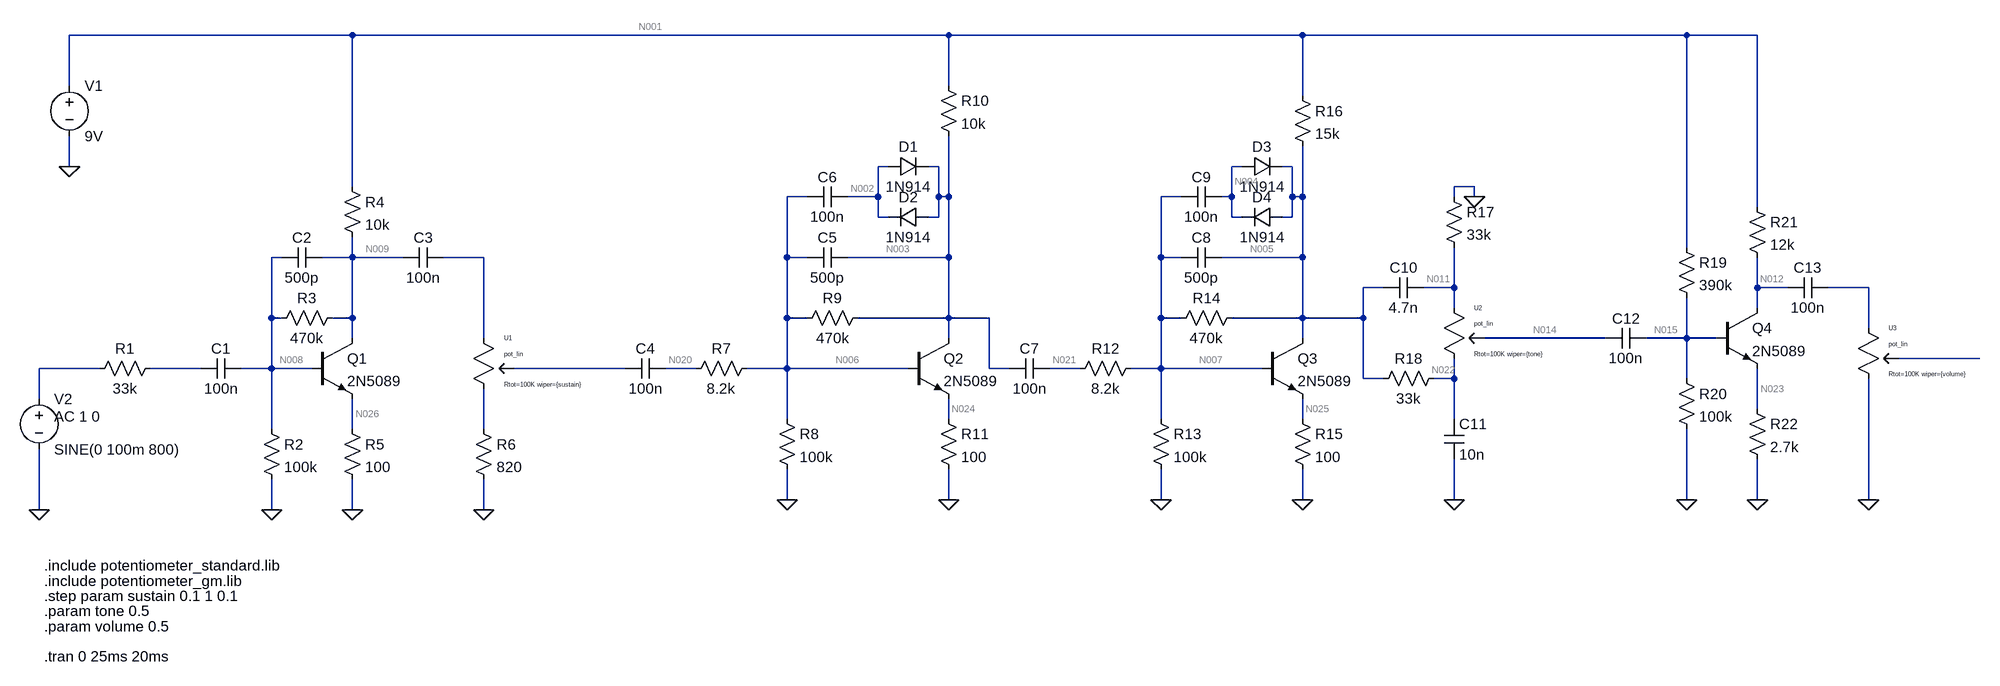
[diagram p0: schematic triangle.asc]
triangle.asc, the LTspice schematic file:
Version 4
SHEET 1 3376 680
WIRE 640 -944 192 -944
WIRE 1584 -944 640 -944
WIRE 2144 -944 1584 -944
WIRE 2752 -944 2144 -944
WIRE 2864 -944 2752 -944
WIRE 192 -864 192 -944
WIRE 1584 -864 1584 -944
WIRE 2144 -848 2144 -944
WIRE 192 -736 192 -784
WIRE 1488 -736 1472 -736
WIRE 1568 -736 1552 -736
WIRE 2048 -736 2032 -736
WIRE 2128 -736 2112 -736
WIRE 640 -704 640 -944
WIRE 2416 -704 2384 -704
WIRE 1360 -688 1328 -688
WIRE 1472 -688 1472 -736
WIRE 1472 -688 1424 -688
WIRE 1568 -688 1568 -736
WIRE 1584 -688 1584 -784
WIRE 1584 -688 1568 -688
WIRE 1952 -688 1920 -688
WIRE 2032 -688 2032 -736
WIRE 2032 -688 2016 -688
WIRE 2128 -688 2128 -736
WIRE 2144 -688 2144 -768
WIRE 2144 -688 2128 -688
WIRE 2384 -688 2384 -704
WIRE 2416 -688 2416 -704
WIRE 2864 -672 2864 -944
WIRE 1472 -656 1472 -688
WIRE 1488 -656 1472 -656
WIRE 1568 -656 1568 -688
WIRE 1568 -656 1552 -656
WIRE 2032 -656 2032 -688
WIRE 2048 -656 2032 -656
WIRE 2128 -656 2128 -688
WIRE 2128 -656 2112 -656
WIRE 2752 -608 2752 -944
WIRE 528 -592 512 -592
WIRE 640 -592 640 -624
WIRE 640 -592 592 -592
WIRE 720 -592 640 -592
WIRE 848 -592 784 -592
WIRE 1328 -592 1328 -688
WIRE 1360 -592 1328 -592
WIRE 1584 -592 1584 -688
WIRE 1584 -592 1424 -592
WIRE 1920 -592 1920 -688
WIRE 1952 -592 1920 -592
WIRE 2144 -592 2144 -688
WIRE 2144 -592 2016 -592
WIRE 2272 -544 2240 -544
WIRE 2384 -544 2384 -608
WIRE 2384 -544 2336 -544
WIRE 2864 -544 2864 -592
WIRE 2912 -544 2864 -544
WIRE 3040 -544 2976 -544
WIRE 2384 -512 2384 -544
WIRE 2864 -512 2864 -544
WIRE 512 -496 512 -592
WIRE 528 -496 512 -496
WIRE 640 -496 640 -592
WIRE 640 -496 608 -496
WIRE 1328 -496 1328 -592
WIRE 1360 -496 1328 -496
WIRE 1584 -496 1584 -592
WIRE 1584 -496 1440 -496
WIRE 1648 -496 1584 -496
WIRE 1920 -496 1920 -592
WIRE 1952 -496 1920 -496
WIRE 2144 -496 2144 -592
WIRE 2144 -496 2032 -496
WIRE 2240 -496 2240 -544
WIRE 2240 -496 2144 -496
WIRE 3040 -480 3040 -544
WIRE 640 -464 640 -496
WIRE 848 -464 848 -592
WIRE 1584 -464 1584 -496
WIRE 2144 -464 2144 -496
WIRE 2624 -464 2432 -464
WIRE 2752 -464 2752 -528
WIRE 2752 -464 2688 -464
WIRE 2800 -464 2752 -464
WIRE 3216 -432 3088 -432
WIRE 240 -416 144 -416
WIRE 400 -416 320 -416
WIRE 512 -416 512 -496
WIRE 512 -416 464 -416
WIRE 576 -416 512 -416
WIRE 1072 -416 896 -416
WIRE 1184 -416 1136 -416
WIRE 1328 -416 1328 -496
WIRE 1328 -416 1264 -416
WIRE 1520 -416 1328 -416
WIRE 1648 -416 1648 -496
WIRE 1680 -416 1648 -416
WIRE 1792 -416 1744 -416
WIRE 1920 -416 1920 -496
WIRE 1920 -416 1872 -416
WIRE 2080 -416 1920 -416
WIRE 2240 -400 2240 -496
WIRE 2272 -400 2240 -400
WIRE 2384 -400 2384 -432
WIRE 2384 -400 2352 -400
WIRE 2752 -400 2752 -464
WIRE 144 -368 144 -416
WIRE 2864 -352 2864 -416
WIRE 1328 -336 1328 -416
WIRE 1584 -336 1584 -368
WIRE 1920 -336 1920 -416
WIRE 2144 -336 2144 -368
WIRE 2384 -336 2384 -400
WIRE 512 -320 512 -416
WIRE 640 -320 640 -368
WIRE 848 -320 848 -384
WIRE 1328 -208 1328 -256
WIRE 1584 -208 1584 -256
WIRE 1920 -208 1920 -256
WIRE 2144 -208 2144 -256
WIRE 2384 -208 2384 -272
WIRE 2752 -208 2752 -320
WIRE 2864 -208 2864 -272
WIRE 3040 -208 3040 -400
WIRE 144 -192 144 -288
WIRE 512 -192 512 -240
WIRE 640 -192 640 -240
WIRE 848 -192 848 -240
FLAG 512 -192 0
FLAG 640 -192 0
FLAG 848 -192 0
FLAG 1328 -208 0
FLAG 1584 -208 0
FLAG 1920 -208 0
FLAG 2144 -208 0
FLAG 2384 -208 0
FLAG 2416 -688 0
FLAG 2752 -208 0
FLAG 2864 -208 0
FLAG 3040 -208 0
FLAG 192 -736 0
FLAG 144 -192 0
SYMBOL res 336 -432 R90
WINDOW 0 0 56 VBottom 2
WINDOW 3 32 56 VTop 2
SYMATTR InstName R1
SYMATTR Value 33k
SYMATTR SpiceLine tol=1 pwr=0.1
SYMBOL cap 464 -432 R90
WINDOW 0 0 32 VBottom 2
WINDOW 3 32 32 VTop 2
SYMATTR InstName C1
SYMATTR Value 100n
SYMBOL res 496 -336 R0
SYMATTR InstName R2
SYMATTR Value 100k
SYMBOL res 624 -512 R90
WINDOW 0 0 56 VBottom 2
WINDOW 3 32 56 VTop 2
SYMATTR InstName R3
SYMATTR Value 470k
SYMBOL cap 592 -608 R90
WINDOW 0 0 32 VBottom 2
WINDOW 3 32 32 VTop 2
SYMATTR InstName C2
SYMATTR Value 500p
SYMBOL res 624 -720 R0
SYMATTR InstName R4
SYMATTR Value 10k
SYMBOL cap 784 -608 R90
WINDOW 0 0 32 VBottom 2
WINDOW 3 32 32 VTop 2
SYMATTR InstName C3
SYMATTR Value 100n
SYMBOL npn 576 -464 R0
SYMATTR InstName Q1
SYMATTR Value 2N5089
SYMBOL res 624 -336 R0
SYMATTR InstName R5
SYMATTR Value 100
SYMBOL potentiometer_standard 832 -480 R0
SYMATTR InstName U1
SYMATTR Value Rtot=100K wiper={sustain}
SYMATTR SpiceLine ""
SYMBOL res 832 -336 R0
SYMATTR InstName R6
SYMATTR Value 820
SYMBOL cap 1136 -432 R90
WINDOW 0 0 32 VBottom 2
WINDOW 3 32 32 VTop 2
SYMATTR InstName C4
SYMATTR Value 100n
SYMBOL res 1280 -432 R90
WINDOW 0 0 56 VBottom 2
WINDOW 3 32 56 VTop 2
SYMATTR InstName R7
SYMATTR Value 8.2k
SYMBOL res 1312 -352 R0
SYMATTR InstName R8
SYMATTR Value 100k
SYMBOL res 1456 -512 R90
WINDOW 0 0 56 VBottom 2
WINDOW 3 32 56 VTop 2
SYMATTR InstName R9
SYMATTR Value 470k
SYMBOL cap 1424 -608 R90
WINDOW 0 0 32 VBottom 2
WINDOW 3 32 32 VTop 2
SYMATTR InstName C5
SYMATTR Value 500p
SYMBOL cap 1424 -704 R90
WINDOW 0 0 32 VBottom 2
WINDOW 3 32 32 VTop 2
SYMATTR InstName C6
SYMATTR Value 100n
SYMBOL diode 1488 -720 R270
WINDOW 0 32 32 VTop 2
WINDOW 3 0 32 VBottom 2
SYMATTR InstName D1
SYMATTR Value 1N914
SYMBOL diode 1552 -672 R90
WINDOW 0 0 32 VBottom 2
WINDOW 3 32 32 VTop 2
SYMATTR InstName D2
SYMATTR Value 1N914
SYMBOL res 1568 -880 R0
SYMATTR InstName R10
SYMATTR Value 10k
SYMBOL npn 1520 -464 R0
SYMATTR InstName Q2
SYMATTR Value 2N5089
SYMBOL res 1568 -352 R0
SYMATTR InstName R11
SYMATTR Value 100
SYMBOL cap 1744 -432 R90
WINDOW 0 0 32 VBottom 2
WINDOW 3 32 32 VTop 2
SYMATTR InstName C7
SYMATTR Value 100n
SYMBOL res 1888 -432 R90
WINDOW 0 0 56 VBottom 2
WINDOW 3 32 56 VTop 2
SYMATTR InstName R12
SYMATTR Value 8.2k
SYMBOL res 1904 -352 R0
SYMATTR InstName R13
SYMATTR Value 100k
SYMBOL res 2048 -512 R90
WINDOW 0 0 56 VBottom 2
WINDOW 3 32 56 VTop 2
SYMATTR InstName R14
SYMATTR Value 470k
SYMBOL cap 2016 -608 R90
WINDOW 0 0 32 VBottom 2
WINDOW 3 32 32 VTop 2
SYMATTR InstName C8
SYMATTR Value 500p
SYMBOL cap 2016 -704 R90
WINDOW 0 0 32 VBottom 2
WINDOW 3 32 32 VTop 2
SYMATTR InstName C9
SYMATTR Value 100n
SYMBOL diode 2048 -720 R270
WINDOW 0 32 32 VTop 2
WINDOW 3 0 32 VBottom 2
SYMATTR InstName D3
SYMATTR Value 1N914
SYMBOL diode 2112 -672 R90
WINDOW 0 0 32 VBottom 2
WINDOW 3 32 32 VTop 2
SYMATTR InstName D4
SYMATTR Value 1N914
SYMBOL npn 2080 -464 R0
SYMATTR InstName Q3
SYMATTR Value 2N5089
SYMBOL res 2128 -352 R0
SYMATTR InstName R15
SYMATTR Value 100
SYMBOL res 2128 -864 R0
SYMATTR InstName R16
SYMATTR Value 15k
SYMBOL cap 2336 -560 R90
WINDOW 0 0 32 VBottom 2
WINDOW 3 32 32 VTop 2
SYMATTR InstName C10
SYMATTR Value 4.7n
SYMBOL res 2368 -704 R0
SYMATTR InstName R17
SYMATTR Value 33k
SYMBOL res 2368 -416 R90
WINDOW 0 0 56 VBottom 2
WINDOW 3 32 56 VTop 2
SYMATTR InstName R18
SYMATTR Value 33k
SYMBOL cap 2368 -336 R0
SYMATTR InstName C11
SYMATTR Value 10n
SYMBOL potentiometer_standard 2368 -528 R0
SYMATTR InstName U2
SYMATTR Value Rtot=100K wiper={tone}
SYMATTR SpiceLine ""
SYMBOL cap 2688 -480 R90
WINDOW 0 0 32 VBottom 2
WINDOW 3 32 32 VTop 2
SYMATTR InstName C12
SYMATTR Value 100n
SYMBOL res 2736 -624 R0
SYMATTR InstName R19
SYMATTR Value 390k
SYMBOL res 2736 -416 R0
SYMATTR InstName R20
SYMATTR Value 100k
SYMBOL npn 2800 -512 R0
SYMATTR InstName Q4
SYMATTR Value 2N5089
SYMBOL res 2848 -688 R0
SYMATTR InstName R21
SYMATTR Value 12k
SYMBOL res 2848 -368 R0
SYMATTR InstName R22
SYMATTR Value 2.7k
SYMBOL cap 2976 -560 R90
WINDOW 0 0 32 VBottom 2
WINDOW 3 32 32 VTop 2
SYMATTR InstName C13
SYMATTR Value 100n
SYMBOL potentiometer_standard 3024 -496 R0
SYMATTR InstName U3
SYMATTR Value Rtot=100K wiper={volume}
SYMATTR SpiceLine ""
SYMBOL voltage 192 -880 R0
WINDOW 123 0 0 Left 2
WINDOW 39 0 0 Left 2
SYMATTR InstName V1
SYMATTR Value 9V
SYMBOL voltage 144 -384 R0
WINDOW 123 24 44 Left 2
WINDOW 39 0 0 Left 2
SYMATTR Value2 AC 1 0
SYMATTR InstName V2
SYMATTR Value SINE(0 100m 800)
TEXT 152 -104 Left 2 !.include potentiometer_standard.lib
TEXT 152 -80 Left 2 !.include potentiometer_gm.lib
TEXT 152 -56 Left 2 !.step param sustain 0.1 1 0.1
TEXT 152 -32 Left 2 !.param tone 0.5
TEXT 152 -8 Left 2 !.param volume 0.5
TEXT 152 40 Left 2 !.tran 0 25ms 20ms

The netlist it stands for:
* triangle.asc
R1 N018 N017 33k tol=1 pwr=0.1
C1 N008 N018 100n
R2 N008 0 100k
R3 N009 N008 470k
C2 N009 N008 500p
R4 N001 N009 10k
C3 N010 N009 100n
Q1 N009 N008 N026 0 2N5089
R5 N026 0 100
XU1 N010 N027 N019 pot_lin Rtot=100K wiper={sustain}  ; pins A B C
R6 N027 0 820
C4 N020 N019 100n
R7 N006 N020 8.2k
R8 N006 0 100k
R9 N003 N006 470k
C5 N003 N006 500p
C6 N002 N006 100n
D1 N002 N003 1N914
D2 N003 N002 1N914
R10 N001 N003 10k
Q2 N003 N006 N024 0 2N5089
R11 N024 0 100
C7 N021 N003 100n
R12 N007 N021 8.2k
R13 N007 0 100k
R14 N005 N007 470k
C8 N005 N007 500p
C9 N004 N007 100n
D3 N004 N005 1N914
D4 N005 N004 1N914
Q3 N005 N007 N025 0 2N5089
R15 N025 0 100
R16 N001 N005 15k
C10 N011 N005 4.7n
R17 0 N011 33k
R18 N022 N005 33k
C11 N022 0 10n
XU2 N011 N022 N014 pot_lin Rtot=100K wiper={tone}  ; pins A B C
C12 N015 N014 100n
R19 N001 N015 390k
R20 N015 0 100k
Q4 N012 N015 N023 0 2N5089
R21 N001 N012 12k
R22 N023 0 2.7k
C13 N013 N012 100n
XU3 N013 0 N016 pot_lin Rtot=100K wiper={volume}  ; pins A B C
V1 N001 0 9V
V2 N017 0 SINE(0 100m 800) AC 1 0
.model D D
.lib standard.dio
.model NPN NPN
.model PNP PNP
.lib standard.bjt
.include potentiometer_standard.lib
.include potentiometer_gm.lib
.step param sustain 0.1 1 0.1
.param tone 0.5
.param volume 0.5
.tran 0 25ms 20ms
.backanno
.end

* Results of the author's LTspice run, read from the files saved beside the schematic
* Operating Point (first step), zero values left out:
*   sustain = 100 m
*   V(n008) = 695.3 mV
*   V(n009) = 4.24 V
*   V(n001) = 9 V
*   V(n026) = 46.9 mV
*   V(n020) = 695.3 mV
*   V(n006) = 695.3 mV
*   V(n003) = 4.24 V
*   V(n002) = 4.24 V
*   V(n024) = 46.9 mV
*   V(n021) = 667.3 mV
*   V(n007) = 667.3 mV
*   V(n005) = 3.993 V
*   V(n004) = 3.993 V
*   V(n025) = 30.31 mV
*   V(n011) = 793.7 mV
*   V(n022) = 3.199 V
*   V(n014) = 1.996 V
*   V(n015) = 1.793 V
*   V(n012) = 3.911 V
*   V(n023) = 1.147 V
*   Ic(Q4) = 424.1 µA
*   Ib(Q4) = 550.1 nA
*   Ie(Q4) = -424.7 µA
*   Ic(Q3) = 302.7 µA
*   Ib(Q3) = 402.7 nA
*   Ie(Q3) = -303.2 µA
*   Ic(Q2) = 468.4 µA
*   Ib(Q2) = 589.2 nA
*   Ie(Q2) = -469 µA
*   Ic(Q1) = 468.4 µA
*   Ib(Q1) = 589.2 nA
*   Ie(Q1) = -469 µA
*   I(R22) = 424.7 µA
*   I(R21) = 424.1 µA
*   I(R20) = 17.93 µA
*   I(R19) = 18.48 µA
*   I(R18) = -24.05 µA
*   I(R17) = -24.05 µA
*   I(R16) = 333.8 µA
*   I(R15) = 303.1 µA
*   I(R14) = 7.075 µA
*   I(R13) = 6.673 µA
*   I(R11) = 469 µA
*   I(R10) = 476 µA
*   I(R9) = 7.542 µA
*   I(R8) = 6.953 µA
*   I(R5) = 469 µA
*   I(R4) = 476 µA
*   I(R3) = 7.542 µA
*   I(R2) = 6.953 µA
*   I(V1) = -1.728 mA
*   Ix(u2:1) = -24.05 µA
*   Ix(u2:2) = 24.05 µA
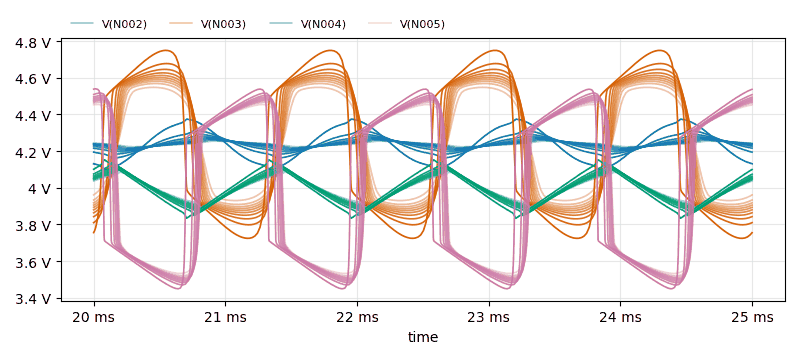
[diagram p1: Transient Analysis of triangle.asc, plotted from the saved traces]
* Transient Analysis, 10 runs:
*   V(N002) [sustain=0.1]: min 4.224 V, max 4.254 V, average 4.239 V, rms 4.239 V, last 4.244 V
*   V(N002) [sustain=0.2]: min 4.219 V, max 4.258 V, average 4.239 V, rms 4.239 V, last 4.242 V
*   V(N002) [sustain=0.3]: min 4.216 V, max 4.261 V, average 4.239 V, rms 4.239 V, last 4.24 V
*   V(N002) [sustain=0.4]: min 4.213 V, max 4.265 V, average 4.239 V, rms 4.239 V, last 4.238 V
*   V(N002) [sustain=0.5]: min 4.209 V, max 4.268 V, average 4.239 V, rms 4.239 V, last 4.235 V
*   V(N002) [sustain=0.6]: min 4.204 V, max 4.273 V, average 4.239 V, rms 4.239 V, last 4.231 V
*   V(N002) [sustain=0.7]: min 4.196 V, max 4.281 V, average 4.238 V, rms 4.238 V, last 4.226 V
*   V(N002) [sustain=0.8]: min 4.184 V, max 4.292 V, average 4.238 V, rms 4.238 V, last 4.216 V
*   V(N003) [sustain=0.1]: min 3.93 V, max 4.548 V, average 4.239 V, rms 4.247 V, last 3.961 V
*   V(N003) [sustain=0.2]: min 3.909 V, max 4.569 V, average 4.239 V, rms 4.248 V, last 3.933 V
*   V(N003) [sustain=0.3]: min 3.896 V, max 4.581 V, average 4.239 V, rms 4.249 V, last 3.918 V
*   V(N003) [sustain=0.4]: min 3.886 V, max 4.591 V, average 4.239 V, rms 4.25 V, last 3.905 V
*   V(N003) [sustain=0.5]: min 3.876 V, max 4.601 V, average 4.239 V, rms 4.25 V, last 3.893 V
*   V(N003) [sustain=0.6]: min 3.864 V, max 4.613 V, average 4.238 V, rms 4.251 V, last 3.88 V
*   V(N003) [sustain=0.7]: min 3.85 V, max 4.627 V, average 4.238 V, rms 4.252 V, last 3.863 V
*   V(N003) [sustain=0.8]: min 3.83 V, max 4.646 V, average 4.238 V, rms 4.253 V, last 3.842 V
*   V(N004) [sustain=0.1]: min 3.901 V, max 4.085 V, average 3.993 V, rms 3.993 V, last 4.037 V
*   V(N004) [sustain=0.2]: min 3.891 V, max 4.094 V, average 3.993 V, rms 3.993 V, last 4.041 V
*   V(N004) [sustain=0.3]: min 3.885 V, max 4.1 V, average 3.993 V, rms 3.993 V, last 4.044 V
*   V(N004) [sustain=0.4]: min 3.88 V, max 4.105 V, average 3.993 V, rms 3.993 V, last 4.047 V
*   V(N004) [sustain=0.5]: min 3.875 V, max 4.109 V, average 3.992 V, rms 3.993 V, last 4.05 V
*   V(N004) [sustain=0.6]: min 3.871 V, max 4.114 V, average 3.993 V, rms 3.993 V, last 4.053 V
*   V(N004) [sustain=0.7]: min 3.865 V, max 4.12 V, average 3.993 V, rms 3.993 V, last 4.058 V
*   V(N004) [sustain=0.8]: min 3.858 V, max 4.127 V, average 3.993 V, rms 3.993 V, last 4.064 V
*   V(N005) [sustain=0.1]: min 3.532 V, max 4.454 V, average 3.993 V, rms 4.013 V, last 4.452 V
*   V(N005) [sustain=0.2]: min 3.521 V, max 4.465 V, average 3.993 V, rms 4.014 V, last 4.461 V
*   V(N005) [sustain=0.3]: min 3.514 V, max 4.472 V, average 3.993 V, rms 4.014 V, last 4.466 V
*   V(N005) [sustain=0.4]: min 3.508 V, max 4.478 V, average 3.993 V, rms 4.014 V, last 4.47 V
*   V(N005) [sustain=0.5]: min 3.503 V, max 4.483 V, average 3.993 V, rms 4.015 V, last 4.475 V
*   V(N005) [sustain=0.6]: min 3.497 V, max 4.489 V, average 3.993 V, rms 4.015 V, last 4.48 V
*   V(N005) [sustain=0.7]: min 3.49 V, max 4.496 V, average 3.993 V, rms 4.015 V, last 4.486 V
*   V(N005) [sustain=0.8]: min 3.481 V, max 4.505 V, average 3.993 V, rms 4.016 V, last 4.495 V